# EAGLE design maplemini (EAGLE 8.2.0)
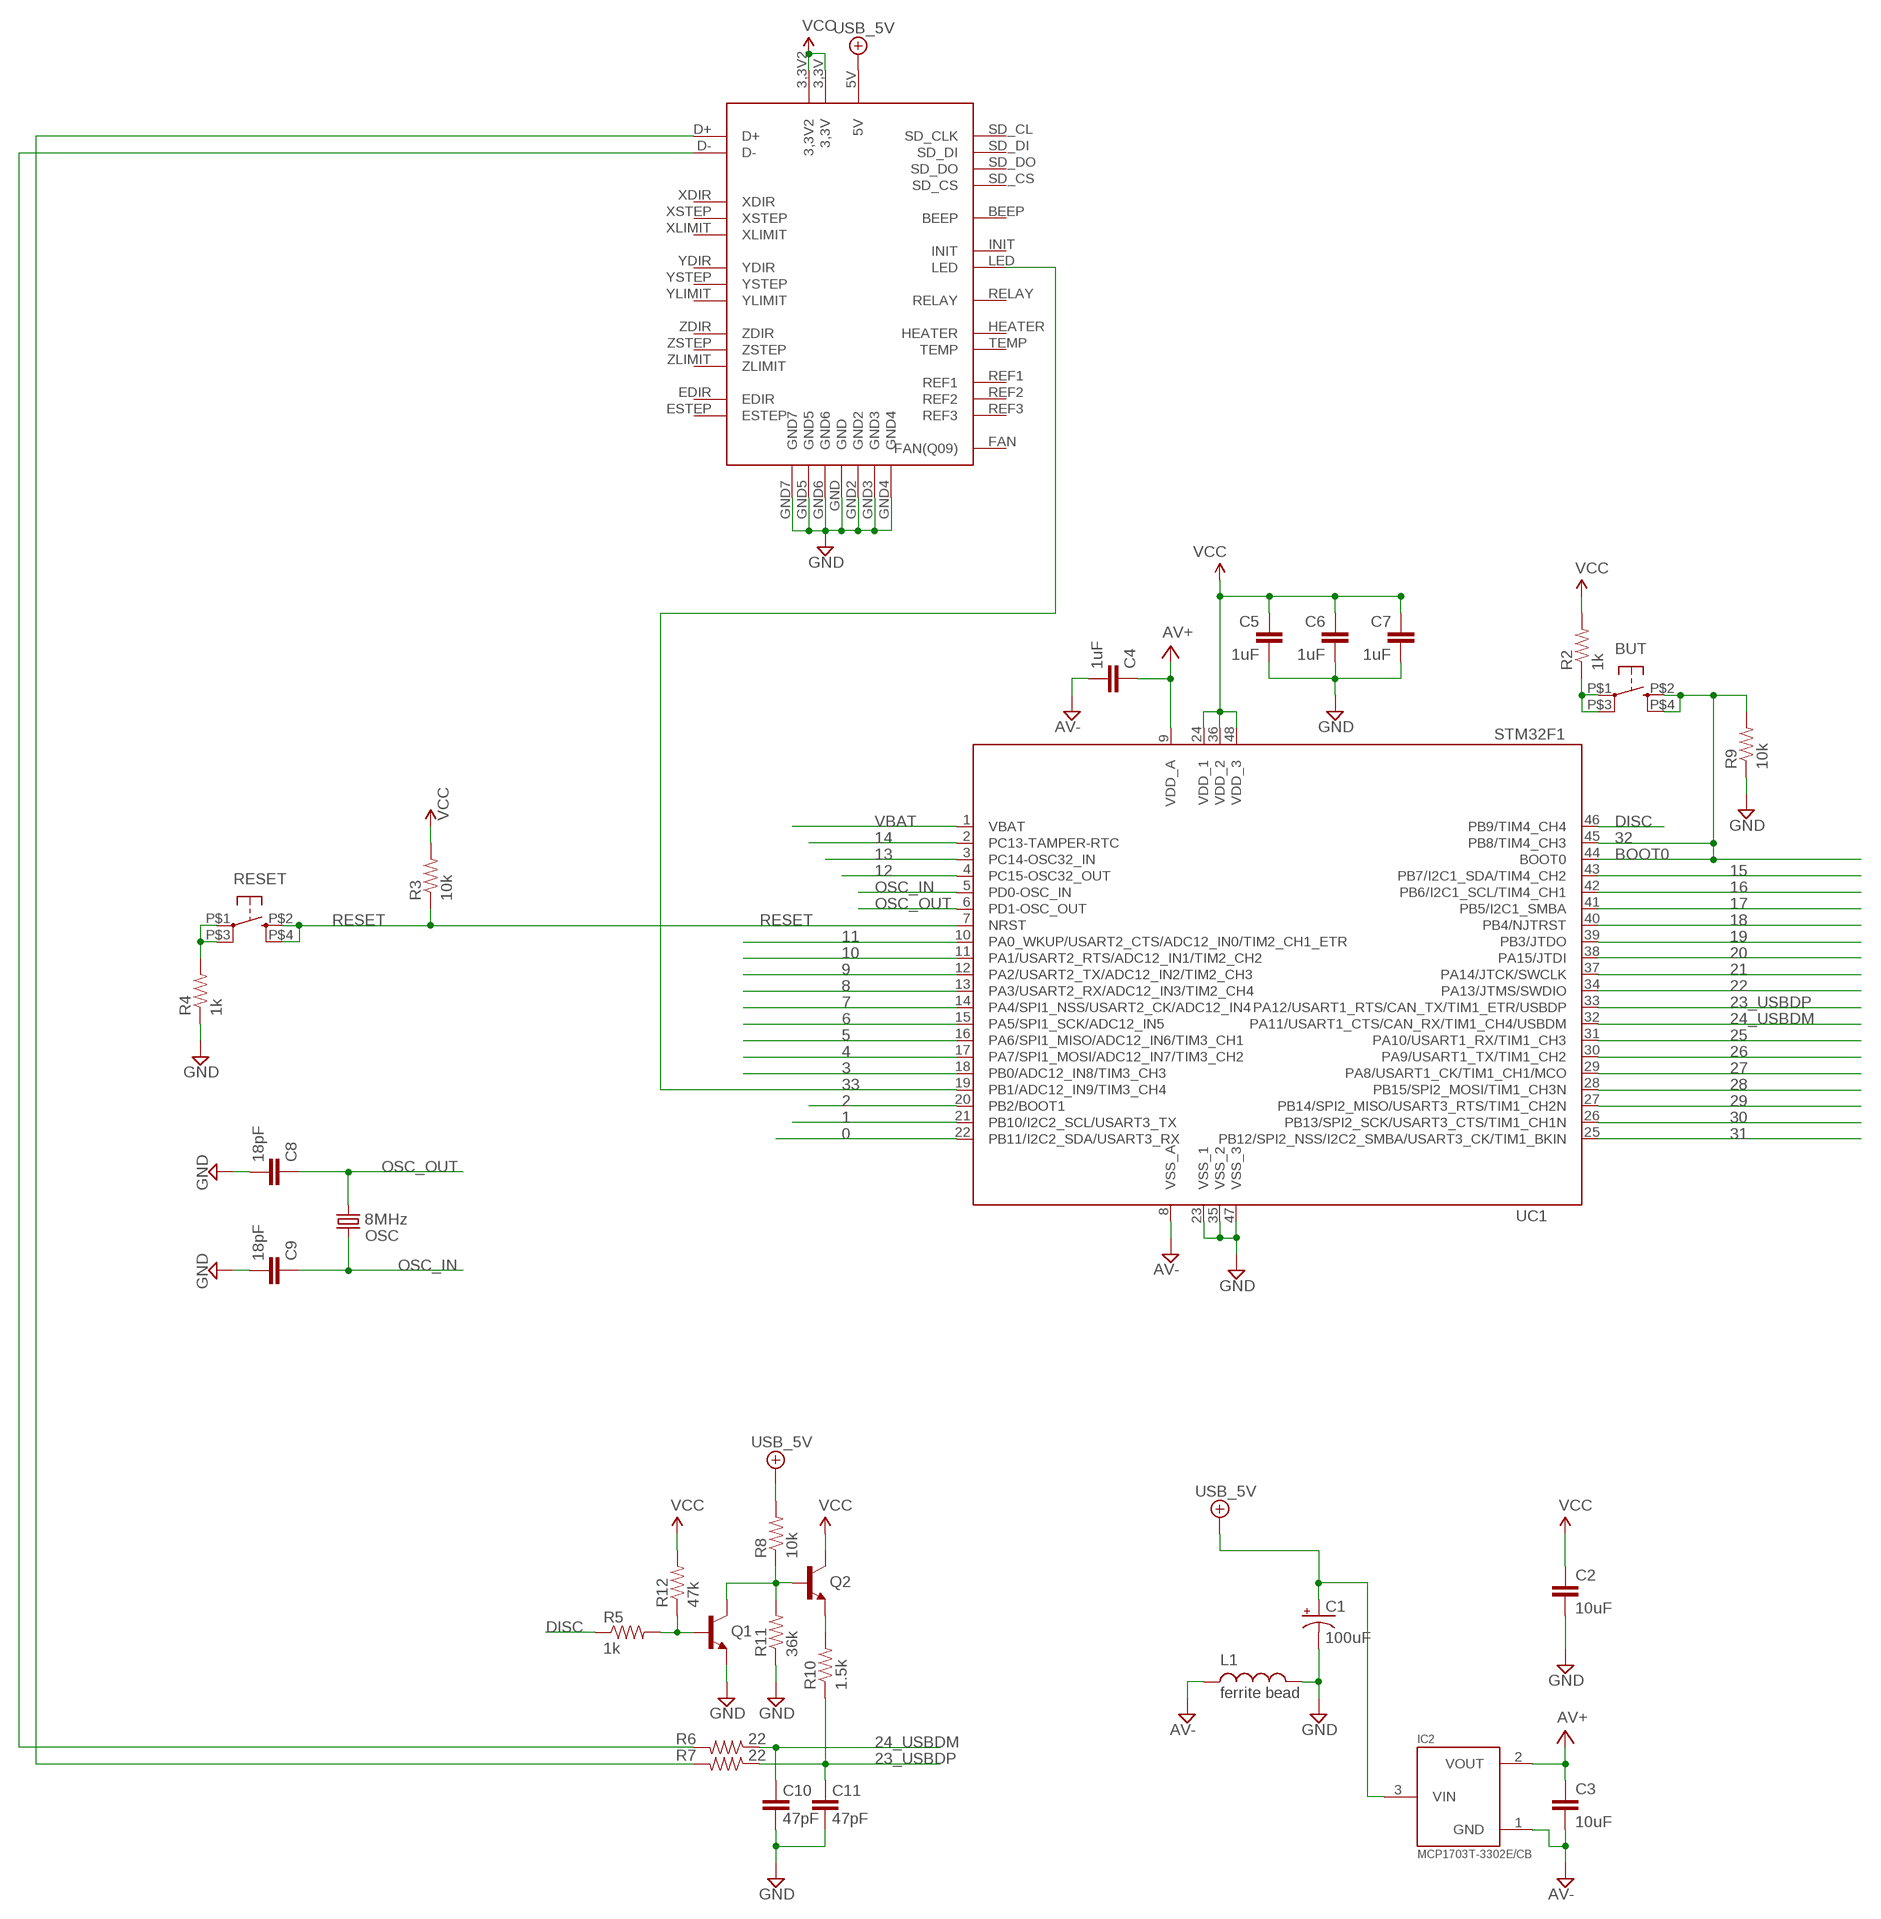
[diagram p0: schematic, sheet 1]

## Parts
BUT  KMR211GLFS  BUTTON-KMR241GLFS  [PUSHBUTTON-KMR241GLFS]
C1  100uF  CAP_POL1206  [EIA3216]
C2  10uF  CAP0805  [0805]
C3  10uF  CAP0805  [0805]
C4  1uF  CAP0402  [C0402]
C5  1uF  CAP0402  [C0402]
C6  1uF  CAP0402  [C0402]
C7  1uF  CAP0402  [C0402]
C8  18pF  CAP0402  [C0402]
C9  18pF  CAP0402  [C0402]
C10  47pF  CAP0402  [C0402]
C11  47pF  CAP0402  [C0402]
IC2  MCP1703T-3302E/CB  MCP1700T  [SOT23]
L1  ferrite bead  INDUCTOR0603  [0603]
OSC  8MHz  CRYSTAL5X3  [CRYSTAL-SMD-5X3]
Q1  NPN-BJT  TRANSISTOR_NPNSOT23  [SOT23]
Q2  NPN-BJT  TRANSISTOR_NPNSOT23  [SOT23]
R2  1k  RESISTOR0402  [C0402]
R3  10k  RESISTOR0402  [C0402]
R4  1k  RESISTOR0402  [C0402]
R5  1k  RESISTOR0402  [C0402]
R6  22  RESISTOR0402  [C0402]
R7  22  RESISTOR0402  [C0402]
R8  10k  RESISTOR0402  [C0402]
R9  10k  RESISTOR0402  [C0402]
R10  1.5k  RESISTOR0402  [C0402]
R11  36k  RESISTOR0402  [C0402]
R12  47k  RESISTOR0402  [C0402]
RESET  KMR211GLFS  BUTTON-KMR241GLFS  [PUSHBUTTON-KMR241GLFS]
U$1  CETUS_CONTROLLER  [CETUS_CONTROLLER]
UC1  STM32F1  STM32F103CB  [LQFP48]

## Nets
0: UC1.22(PB11/I2C2_SDA/USART3_RX)
1: UC1.21(PB10/I2C2_SCL/USART3_TX)
2: UC1.20(PB2/BOOT1)
3: UC1.18(PB0/ADC12_IN8/TIM3_CH3)
4: UC1.17(PA7/SPI1_MOSI/ADC12_IN7/TIM3_CH2)
5: UC1.16(PA6/SPI1_MISO/ADC12_IN6/TIM3_CH1)
6: UC1.15(PA5/SPI1_SCK/ADC12_IN5)
7: UC1.14(PA4/SPI1_NSS/USART2_CK/ADC12_IN4)
8: UC1.13(PA3/USART2_RX/ADC12_IN3/TIM2_CH4)
9: UC1.12(PA2/USART2_TX/ADC12_IN2/TIM2_CH3)
10: UC1.11(PA1/USART2_RTS/ADC12_IN1/TIM2_CH2)
11: UC1.10(PA0_WKUP/USART2_CTS/ADC12_IN0/TIM2_CH1_ETR)
12: UC1.4(PC15-OSC32_OUT)
13: UC1.3(PC14-OSC32_IN)
14: UC1.2(PC13-TAMPER-RTC)
15: UC1.43(PB7/I2C1_SDA/TIM4_CH2)
16: UC1.42(PB6/I2C1_SCL/TIM4_CH1)
17: UC1.41(PB5/I2C1_SMBA)
18: UC1.40(PB4/NJTRST)
19: UC1.39(PB3/JTDO)
20: UC1.38(PA15/JTDI)
21: UC1.37(PA14/JTCK/SWCLK)
22: UC1.34(PA13/JTMS/SWDIO)
23_USBDP: C11.2 R7.1 R10.1 UC1.33(PA12/USART1_RTS/CAN_TX/TIM1_ETR/USBDP)
24_USBDM: C10.2 R6.1 UC1.32(PA11/USART1_CTS/CAN_RX/TIM1_CH4/USBDM)
25: UC1.31(PA10/USART1_RX/TIM1_CH3)
26: UC1.30(PA9/USART1_TX/TIM1_CH2)
27: UC1.29(PA8/USART1_CK/TIM1_CH1/MCO)
28: UC1.28(PB15/SPI2_MOSI/TIM1_CH3N)
29: UC1.27(PB14/SPI2_MISO/USART3_RTS/TIM1_CH2N)
30: UC1.26(PB13/SPI2_SCK/USART3_CTS/TIM1_CH1N)
31: UC1.25(PB12/SPI2_NSS/I2C2_SMBA/USART3_CK/TIM1_BKIN)
32: BUT.P$2 BUT.P$4 R9.2 UC1.44(BOOT0) UC1.45(PB8/TIM4_CH3)
33: U$1.LED UC1.19(PB1/ADC12_IN9/TIM3_CH4)
+5V/2: C1.A(+) IC2.3(VIN) R8.2 U$1.5V ; supply symbol labelled USB_5V
AV+: C3.1 C4.1 IC2.2(VOUT) UC1.9(VDD_A)
AV-: C3.2 C4.2 IC2.1(GND) L1.1 UC1.8(VSS_A)
DGND: C1.C(-) C2.2 C5.2 C6.2 C7.2 C8.2 C9.2 C10.1 C11.1 L1.2 Q1.2(E) R4.1 R9.1 R11.1 UC1.23(VSS_1) UC1.35(VSS_2) UC1.47(VSS_3) ; supply symbol labelled GND
DISC: R5.1 UC1.46(PB9/TIM4_CH4)
GND: U$1.GND U$1.GND2 U$1.GND3 U$1.GND4 U$1.GND5 U$1.GND6 U$1.GND7
N$1: BUT.P$1 BUT.P$3 R2.1
N$4: R4.2 RESET.P$1 RESET.P$3
N$51: Q2.2(E) R10.2
N$59: R6.2 U$1.D-
N$60: R7.2 U$1.D+
N$71: Q1.3(C) Q2.1(B) R8.1 R11.2
N$73: Q1.1(B) R5.2 R12.1
OSC_IN: C9.1 OSC.3 UC1.5(PD0-OSC_IN)
OSC_OUT: C8.1 OSC.1 UC1.6(PD1-OSC_OUT)
RESET: R3.1 RESET.P$2 RESET.P$4 UC1.7(NRST)
VBAT: UC1.1(VBAT)
VCC: C2.1 C5.1 C6.1 C7.1 Q2.3(C) R2.2 R3.2 R12.2 U$1.3,3V U$1.3,3V2 UC1.24(VDD_1) UC1.36(VDD_2) UC1.48(VDD_3)
Unconnected: U$1.BEEP U$1.EDIR U$1.ESTEP U$1.FAN(FAN(Q09)) U$1.HEATER U$1.INIT U$1.REF1 U$1.REF2 U$1.REF3 U$1.RELAY U$1.SD_CL(SD_CLK) U$1.SD_CS U$1.SD_DI U$1.SD_DO U$1.TEMP U$1.XDIR U$1.XLIMIT U$1.XSTEP U$1.YDIR U$1.YLIMIT U$1.YSTEP U$1.ZDIR U$1.ZLIMIT U$1.ZSTEP

## Notes on the sheet
- BOOT0

## Library data of the parts
BUT RESET = okie:BUTTON-KMR241GLFS
C1 = SparkFun3:CAP_POL: Capacitor Polarized These are standard SMD and PTH capacitors. Normally 10uF, 47uF, and 100uF in electrolytic and tantalum varieties. Always verify the external diameter of the through hole cap, it varies with capacity, voltage, and manufacturer. The EIA devices should be standard.
C2 C3 = SparkFun2:CAP: Capacitor Standard 0603 ceramic capacitor, and 0.1" leaded capacitor.
C4-C11 = SparkFun:CAP: Capacitor Standard 0603 ceramic capacitor, and 0.1" leaded capacitor.
IC2 = okie:MCP1700T
L1 = SparkFun3:INDUCTOR: Inductors Basic Inductor/Choke - 0603 and 1206. Footprints are not proven and vary greatly between part numbers.
OSC = SparkFun2:CRYSTAL: Crystals Various standard crystals. Proven footprints. Spark Fun Electronics SKU : COM-00534
Q1 Q2 = SparkFun2:TRANSISTOR_NPN: Transistor NPN BJT configuration in SOT23 package. MMBT2222 is the common NPN we use. Double check BCE configuration again layout.
R2-R12 = SparkFun:RESISTOR: Resistor Basic schematic elements and footprints for 0603, 1206, and PTH 1/10th watt (small) resistors.
U$1 = cetus:CETUS_CONTROLLER
UC1 = stm32:STM32F103CB

## Net classes
1 vcc: width 0.254 mm

## Board
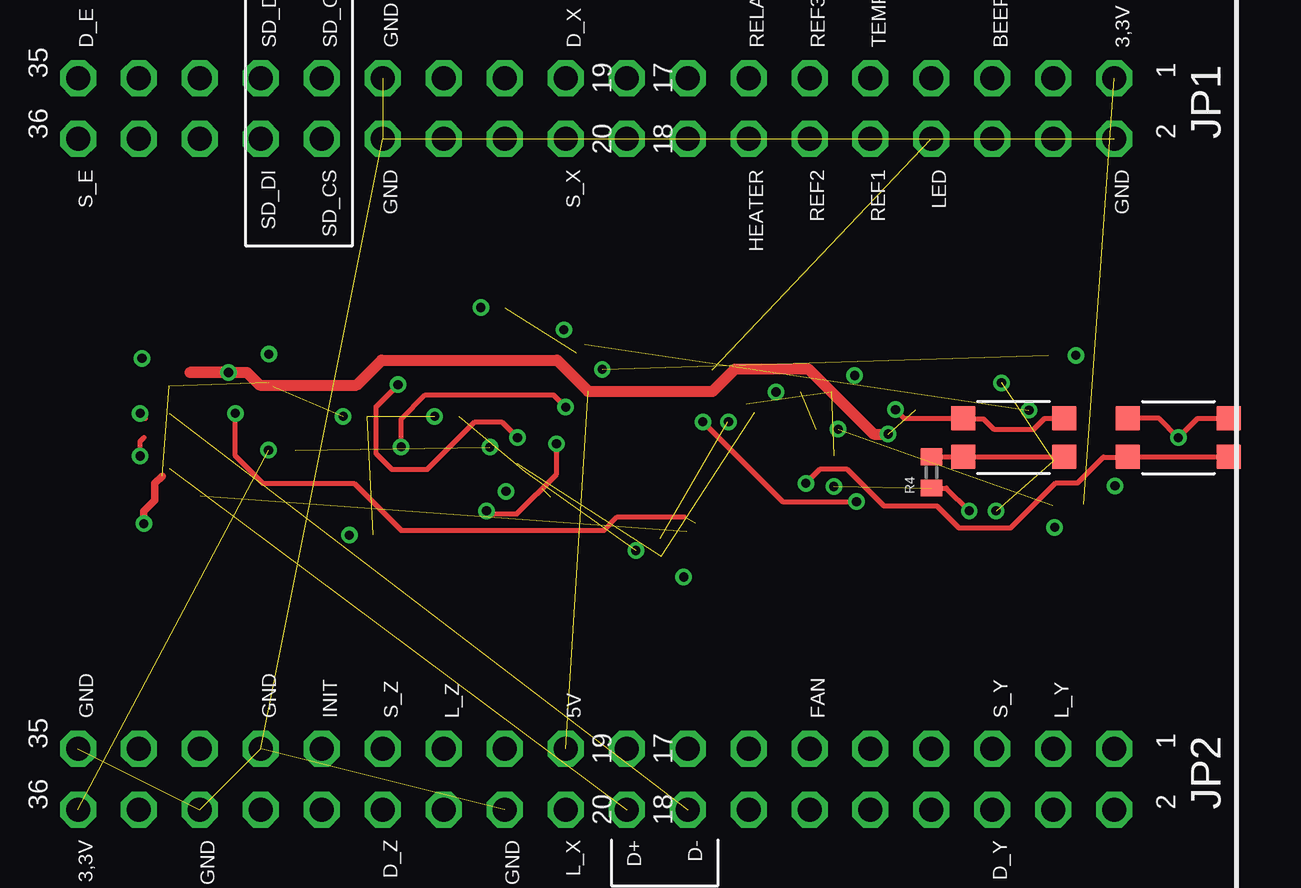
[diagram p1: board, top side]
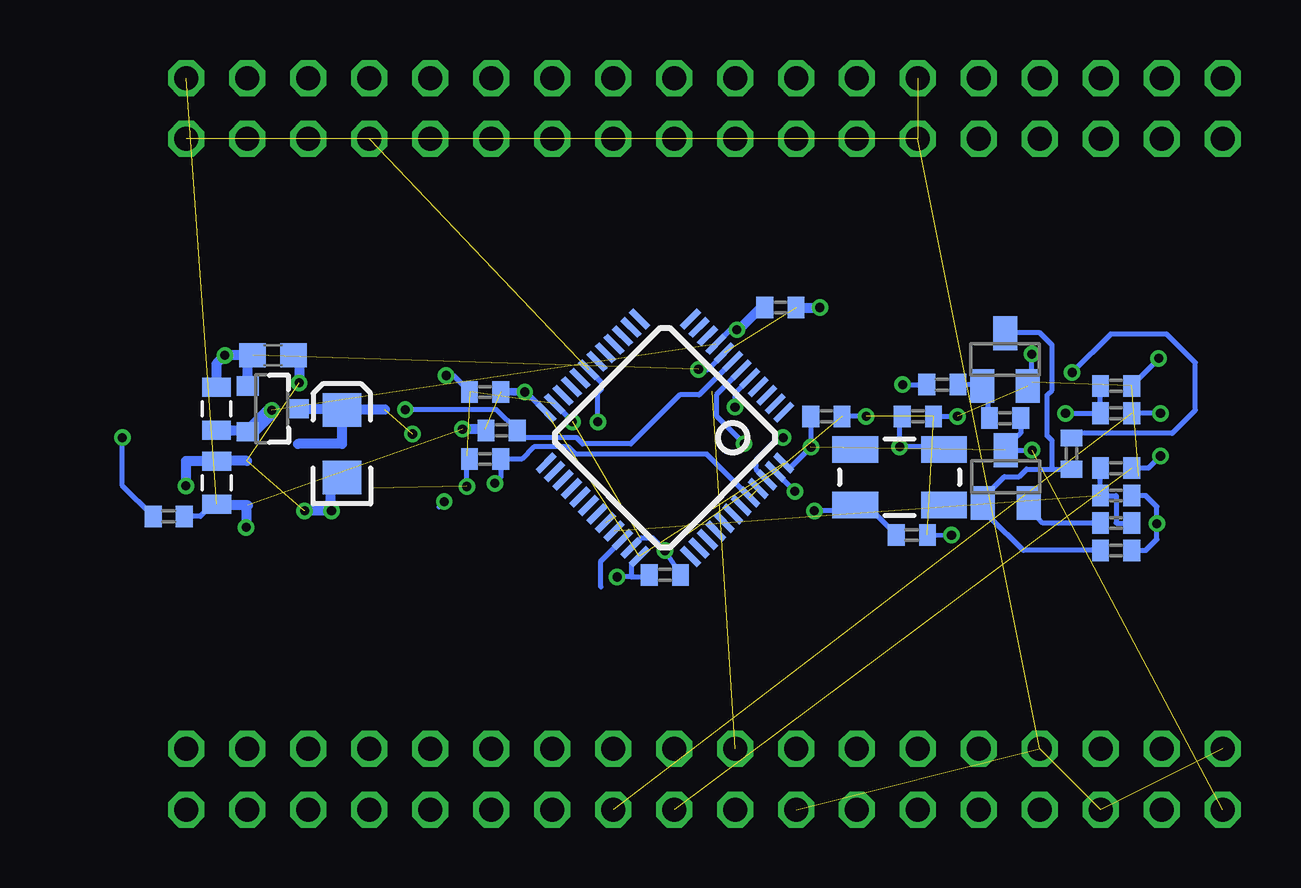
[diagram p2: board, bottom side, seen from below]

No outline drawn. Coordinates in mm, seen from the top.
Copper layers (1*16): Top 0.035mm / dielectric 1.5mm / Bottom 0.035mm
Design rules "default *": minimum track width 6mil, minimum drill 15mil, track to track 6mil, track to pad 6mil, pad to pad 6mil, via to via 6mil, smd to smd 6mil, copper to edge 12mil, drill to drill 15mil, minimum pad ring 6mil, minimum via ring 6mil, stop-mask expansion 0mil, vias tented up to drill 15mil, thermal gap 8mil

### Footprints (pad centres in the part's own frame; a part is rotated, then mirrored left to right if it is on the bottom)
PUSHBUTTON-KMR241GLFS = smd 1 x 1: P$1 2.1,0.8; P$2 2.1,-0.8; P$3 -2.1,0.8; P$4 -2.1,-0.8
EIA3216 = smd 1.4 x 1.6: A 1.4,0; C -1.4,0
0805 = smd 0.8 x 1.2: 1 -0.9,0; 2 0.9,0
C0402 = smd 0.7 x 0.9: 1 -0.65,0; 2 0.65,0
SOT23 = smd 0.8 x 0.9: 1 -0.95,-1; 2 0.95,-1; 3 0,1.1
0603 = smd 1.1 x 1: 1 -0.85,0; 2 0.85,0
CRYSTAL-SMD-5X3 = smd 1.9 x 1.1: 1 -1.85,-1.15; 2 1.85,-1.15; 3 1.85,1.15; 4 -1.85,1.15
SOT23' = smd 1 x 1.4: 1 -0.95,-1.1; 2 0.95,-1.1; 3 0,1.1
CETUS_CONTROLLER = drill 1 octagon: 3,3V -15.24,21.59; 3,3V2 15.24,-21.59; 5V -12.7,1.27; BEEP 15.24,-16.51; D+ -15.24,-1.27; D- -15.24,-3.81; EDIR 15.24,21.59; ESTEP 12.7,21.59; FAN -12.7,-8.89; GND -12.7,21.59; GND2 12.7,-21.59; GND3 -15.24,16.51; GND4 -12.7,13.97; GND5 -15.24,3.81; GND6 12.7,8.89; GND7 15.24,8.89; HEATER 12.7,-6.35; INIT -12.7,11.43; LED 12.7,-13.97; P2_1 -12.7,-21.59; P2_2 -15.24,-21.59; P2_4 -15.24,-19.05; P2_7 -12.7,-13.97; P2_9 -12.7,-11.43; P2_10 -15.24,-11.43; P2_12 -15.24,-8.89; P2_13 -12.7,-6.35; P2_14 -15.24,-6.35; P2_15 -12.7,-3.81; P2_17 -12.7,-1.27; P2_21 -12.7,3.81; P2_24 -15.24,6.35; P2_28 -15.24,11.43; P2_30 -15.24,13.97; P2_31 -12.7,16.51; P2_33 -12.7,19.05; P2_34 -15.24,19.05; P$2 12.7,-1.27; P$5 12.7,3.81; P$8 12.7,6.35; P$10 12.7,-3.81; P$27 15.24,-3.81; P$28 15.24,-1.27; P$30 15.24,3.81; P$31 15.24,6.35; P$45 12.7,16.51; P$46 12.7,19.05; P$49 15.24,19.05; P$50 15.24,16.51; P$56 -15.24,-13.97; P$59 15.24,-13.97; P$61 12.7,-16.51; P$62 12.7,-19.05; P$65 15.24,-19.05; REF1 12.7,-11.43; REF2 12.7,-8.89; REF3 15.24,-8.89; RELAY 15.24,-6.35; SD_CL 15.24,11.43; SD_CS 12.7,11.43; SD_DI 12.7,13.97; SD_DO 15.24,13.97; TEMP 15.24,-11.43; XDIR 15.24,1.27; XLIMIT -15.24,1.27; XSTEP 12.7,1.27; YDIR -15.24,-16.51; YLIMIT -12.7,-19.05; YSTEP -12.7,-16.51; ZDIR -15.24,8.89; ZLIMIT -12.7,6.35; ZSTEP -12.7,8.89
LQFP48 = smd 0.254 x 1: 1 -2.75,-4.25; 2 -2.25,-4.25; 3 -1.75,-4.25; 4 -1.25,-4.25; 5 -0.75,-4.25; 6 -0.25,-4.25; 7 0.25,-4.25; 8 0.75,-4.25; 9 1.25,-4.25; 10 1.75,-4.25; 11 2.25,-4.25; 12 2.75,-4.25; 25 2.75,4.25; 26 2.25,4.25; 27 1.75,4.25; 28 1.25,4.25; 29 0.75,4.25; 30 0.25,4.25; 31 -0.25,4.25; 32 -0.75,4.25; 33 -1.25,4.25; 34 -1.75,4.25; 35 -2.25,4.25; 36 -2.75,4.25 | smd 1 x 0.254: 13 4.25,-2.75; 14 4.25,-2.25; 15 4.25,-1.75; 16 4.25,-1.25; 17 4.25,-0.75; 18 4.25,-0.25; 19 4.25,0.25; 20 4.25,0.75; 21 4.25,1.25; 22 4.25,1.75; 23 4.25,2.25; 24 4.25,2.75; 37 -4.25,2.75; 38 -4.25,2.25; 39 -4.25,1.75; 40 -4.25,1.25; 41 -4.25,0.75; 42 -4.25,0.25; 43 -4.25,-0.25; 44 -4.25,-0.75; 45 -4.25,-1.25; 46 -4.25,-1.75; 47 -4.25,-2.25; 48 -4.25,-2.75

### Placement (x,y rotation side)
BUT  48.26,9.14 0 top
C1  39.12,8.89 90 bottom
C2  44.32,7.26 90 bottom
C3  44.34,10.35 90 bottom
C4  20.84,14.57 0 bottom
C5  18.92,10.03 0 bottom
C6  25.65,3.43 0 bottom
C7  33.15,11.05 180 bottom
C8  15.37,5.09 0 bottom
C9  15.11,10.03 0 bottom
C10  6.86,11.3 180 bottom
C11  6.86,6.73 180 bottom
IC2  42.04,10.34 270 bottom
L1  41.99,12.57 0 bottom
OSC  15.88,7.49 0 bottom
Q1  NPN-BJT  [SOT23']  11.48,12.4 0 bottom
Q2  NPN-BJT  [SOT23']  11.46,7.52 0 bottom
R2  46.33,5.87 0 bottom
R3  32.46,9.45 180 bottom
R4  37.97,7.7 90 top
R5  14.1,11.35 0 bottom
R6  6.86,10.16 0 bottom
R7  6.86,7.87 0 bottom
R8  8.71,8.48 90 bottom
R9  33.15,8.26 0 bottom
R10  6.86,5.59 180 bottom
R11  6.86,4.45 180 bottom
R12  11.48,9.96 0 bottom
RESET  41.4,9.14 180 top
U$1  24,8.89 90 top
UC1  25.65,9.14 135 bottom

### Tracks (layer width: path | path; a pad name or v marks a point on that pad's centre or on a via)
22
  Bottom 0.203: UC1.34 28.32,4 28.32,2.92
23_USBDP  (1 unrouted)
  Bottom 0.203: R10.1 6.86,5.59 6.86,6.73 C11.2 R7.1
24_USBDM  (via drill 0.38)  (1 unrouted)
  Top 0.203: v8.97,10.16 8.97,8.38 10.11,7.24 13.92,7.24 15.88,5.28 24.33,5.28 24.89,5.84 27.69,5.84
  Bottom 0.203: v8.97,10.16 R6.1 C10.2
32  (via drill 0.38)  (1 unrouted)
  Top 0.203: v32.74,7.24 33.35,7.85 34.44,7.85 35.99,6.3 38.2,6.3 39.12,5.38 41.27,5.38 43.16,7.26 44.07,7.26 45.14,8.33 46.15,8.33 BUT.P$4 BUT.P$2
  Bottom 0.203: UC1.44 23.91,8.46 29.38,8.46 29.68,8.76 31.11,8.76 31.62,8.26 R9.2 32.5,7.48 v32.74,7.24
33  (via drill 0.38)  (1 unrouted)
  Top 0.203: v28.45,9.8 31.77,6.48 v34.85,6.48
  Bottom 0.203: UC1.19 28.3,11.43 28.3,11.18 28.45,11.02 v28.45,9.8 | v34.85,6.48 35.08,6.25
+5V/2  (via drill 0.38)  (2 unrouted)
  Top 0.305: 36.13,9.27 36.12,9.28 v36.17,9.3
  Top 0.457: v8.69,11.86 7.07,11.86 9.45,11.86 9.98,11.33 14.02,11.33 15.06,12.37 22.38,12.37 23.67,11.07 28.85,11.07 29.79,12.01 32.84,12.01 35.56,9.3 v36.17,9.3
  Bottom 0.203: R8.2 8.52,9.32 4.52,9.32 3.56,10.29 3.56,12.27 4.75,13.46 7.09,13.46 v8.69,11.86
  Bottom 0.406: C1.A 39.12,10.31 37.32,10.31 | IC2.3 39.12,10.34 C1.A | 40.94,8.89 39.12,8.89 39.12,10.26 | C1.A 39.12,10.26 | 39.12,10.26 39.06,10.26
AV+  (via drill 0.38)  (1 unrouted)
  Bottom 0.203: UC1.9 22.93,13.64 v22.66,13.64
  Bottom 0.406: C3.1 44.34,9.42 43.04,9.42 | IC2.2 43.04,9.42 | 43.04,9.42 42.9,9.42 | v22.66,13.64 22.58,13.64 21.65,14.57 C4.1
  Bottom 0.66: 42.9,9.42 v42.04,10.29
AV-  (via drill 0.38)  (2 unrouted)
  Bottom 0.203: UC1.8 23.9,11.96 v24.26,11.99
  Bottom 0.406: C3.2 44.35,12.22 v43.99,12.57 L1.1 42.96,12.45 43.05,12.45 43.05,11.31 IC2.1 43.04,11.25 | C4.2 | C4.2 v19.2,14.57
DGND  (via drill 0.38)  (14 unrouted)
  Top 0.203: R4.1 38.6,7.05 v39.55,6.1
  Top 0.305: 5.92,7.54 5.61,7.24 5.61,6.53 5.16,6.07 v5.16,5.56
  Bottom 0.203: v17.27,10.03 C5.2 | C8.2 13.69,5.08 v13.72,5.08 | C6.2 v25.65,4.45 26.16,4.95 26.66,4.95 UC1.35 | R9.1 33.91,8.4 v33.91,7.11 | UC1.23 29.5,9.8 v29.52,9.8 | C7.2 34.48,11.73 v34.77,11.73 | Q1.2 10.36,11.46 v10.36,12.62 | UC1.47 20.32,6.99 v20.24,6.91 | C9.2 v13.46,10.03 | C10.1 5.08,12.43 v5.08,12.45 | C11.1 5.61,6.73 5.16,6.27 v5.16,5.56 5.16,4.9 5.61,4.45 R11.1
  Bottom 0.406: 43.07,8.18 44.31,8.18 C2.2 45.62,8.16 v45.62,7.14 | C1.C 39.57,7.03 39.57,6.12 v39.55,6.1 40.69,6.1 | L1.2 40.89,12.33 v40.89,11.43
  other vias: 40.67,6.1
DISC  (via drill 0.38)
  Top 0.203: v20.73,9.14 20.07,9.8 18.95,9.8 16.97,7.82 15.49,7.82 14.83,8.48 14.83,10.44 v15.75,11.35
  Bottom 0.203: 14.75,11.54 R5.1 v15.75,11.35 | UC1.46 21.87,7.83 21.87,8.2 20.93,9.14 v20.73,9.14
GND  (6 unrouted)
N$1  (via drill 0.38)
  Top 0.203: BUT.P$3 47.46,9.94 v48.26,9.14 49.06,9.94 BUT.P$1
  Bottom 0.203: R2.1 48.26,7.15 v48.26,9.14
N$4
  Top 0.203: R4.2 RESET.P$1 RESET.P$3
N$51
  Bottom 0.203: 10.24,6.71 Q2.2 10.11,6.02 10.11,5.79 9.91,5.59 R10.2
N$59  (via drill 0.38)  (1 unrouted)
  Top 0.203: 5.22,9.94 v5,10.16
  Bottom 0.203: v5,10.16 R6.2
N$60  (via drill 0.38)  (1 unrouted)
  Top 0.203: 5.16,9.14 5,8.99 v5,8.38
  Bottom 0.203: R7.2 5.51,7.87 v5,8.38
N$71
  Bottom 0.203: R11.2 10.72,4.45 12.09,5.82 12.09,6.1 Q2.1 12.4,6.62 11.51,7.52 10.9,7.52 10.58,7.83 9.47,7.83 | 9.47,7.83 R8.1 | 9.47,7.83 9.53,7.83 9.53,9.02 9.73,9.22 9.73,10.92 9.53,11.12 9.53,13.01 10.03,13.51 11.46,13.51 Q1.3
N$73
  Bottom 0.203: R12.1 12.16,9.93 12.19,9.93 12.19,11.06 Q1.1 12.49,11.35 R5.2
OSC_IN  (via drill 0.38)
  Top 0.203: v22.73,10.41 22.23,10.92 16.89,10.92 15.88,9.91 v15.88,8.76
  Bottom 0.203: 13.69,8.64 13.69,8.81 13.85,8.81 OSC.3 14.61,8.64 14.73,8.76 v15.88,8.76 15.88,9.92 C9.1 | UC1.5 22.73,11 v22.73,10.41
OSC_OUT  (via drill 0.38)
  Top 0.203: v22.35,8.89 22.35,7.62 20.7,5.97 19.56,5.97 v19.43,6.1
  Bottom 0.203: OSC.1 18.11,6.73 | UC1.6 23.5,10.95 23.5,10.03 v22.35,8.89 | v19.43,6.1 17.97,6.1 OSC.1 | OSC.1 17.27,6.34 C8.1
RESET  (via drill 0.38)
  Top 0.203: v36.47,10.31 36.84,9.94 RESET.P$2 39.31,9.93 40.13,9.93 40.56,9.5 42.24,9.5 42.69,9.94 RESET.P$4
  Bottom 0.203: UC1.7 24.23,10.92 25.04,10.92 27.08,8.89 29.08,8.89 29.34,9.14 31.83,9.14 31.8,9.17 31.8,9.44 R3.1 32.67,10.31 v36.47,10.31
VCC  (via drill 0.38)  (7 unrouted)
  Bottom 0.203: 26.37,3.37 C6.1 26.39,3.34 27.05,3.34 | C5.1 19.6,9.99 | R12.2 10.83,9.34 11.07,9.09 11.07,9.02 11.47,8.62 | 11.47,8.62 Q2.3 | UC1.24 31.45,11.05 v31.5,11.05 | 27.65,3.26 v27.65,3.34 27.05,3.34 | UC1.36 27.05,3.86 27.05,3.34 | C5.1 19.57,10.02 | UC1.48 20.47,7.85 v19.57,8.75 C5.1 | 11.47,8.62 v10.36,8.62 v10.35,8.62 | R2.2 45.01,5.87 44.81,6.07 44.62,6.07 C2.1
  Bottom 0.305: 32.51,11.05 C7.1 v31.5,11.05
  Bottom 0.406: C2.1 44.32,6.33 43.1,6.33 | 43.04,6.33 43.1,6.33 | 43.1,6.33 v43.1,5.41 | R3.2 33.16,9.5 v34.09,9.5

### Text on the board
_tsilk: av+ | av- | vbat | 14 | 13 | 12 | 11 | 10 | 9 | 8 | 7 | 6 | 5 | 4 | 3 | boot1 | 2 | 1 | 0 | vin | pwm | pwm | pwm | pwm | pwm | pwm | pwm | tx3 | rx3 | max | ain | ain | ain | ain | ain | ain | ain | ain | ain | scl | sda | 5v | reset | tx2 | rx2 | ss | sck | miso | mosi | i2c2 | spi1 | LeafLabs | Maple Mini | r3 | d1=33 | reset | but=32 | i2c1 | sda | scl | usb | rx1 | tx1 | spi2 | pwm | pwm | dp | dm | pwm | pwm | pwm | mosi | miso | sck | ss | vcc | gnd | but | 15 | 16 | 17 | 18 | 19 | 20 | 21 | 22 | 23 | 24 | 25 | 26 | 27 | 28 | 29 | 30 | 31